# Altium project MiniR3.PrjPcb
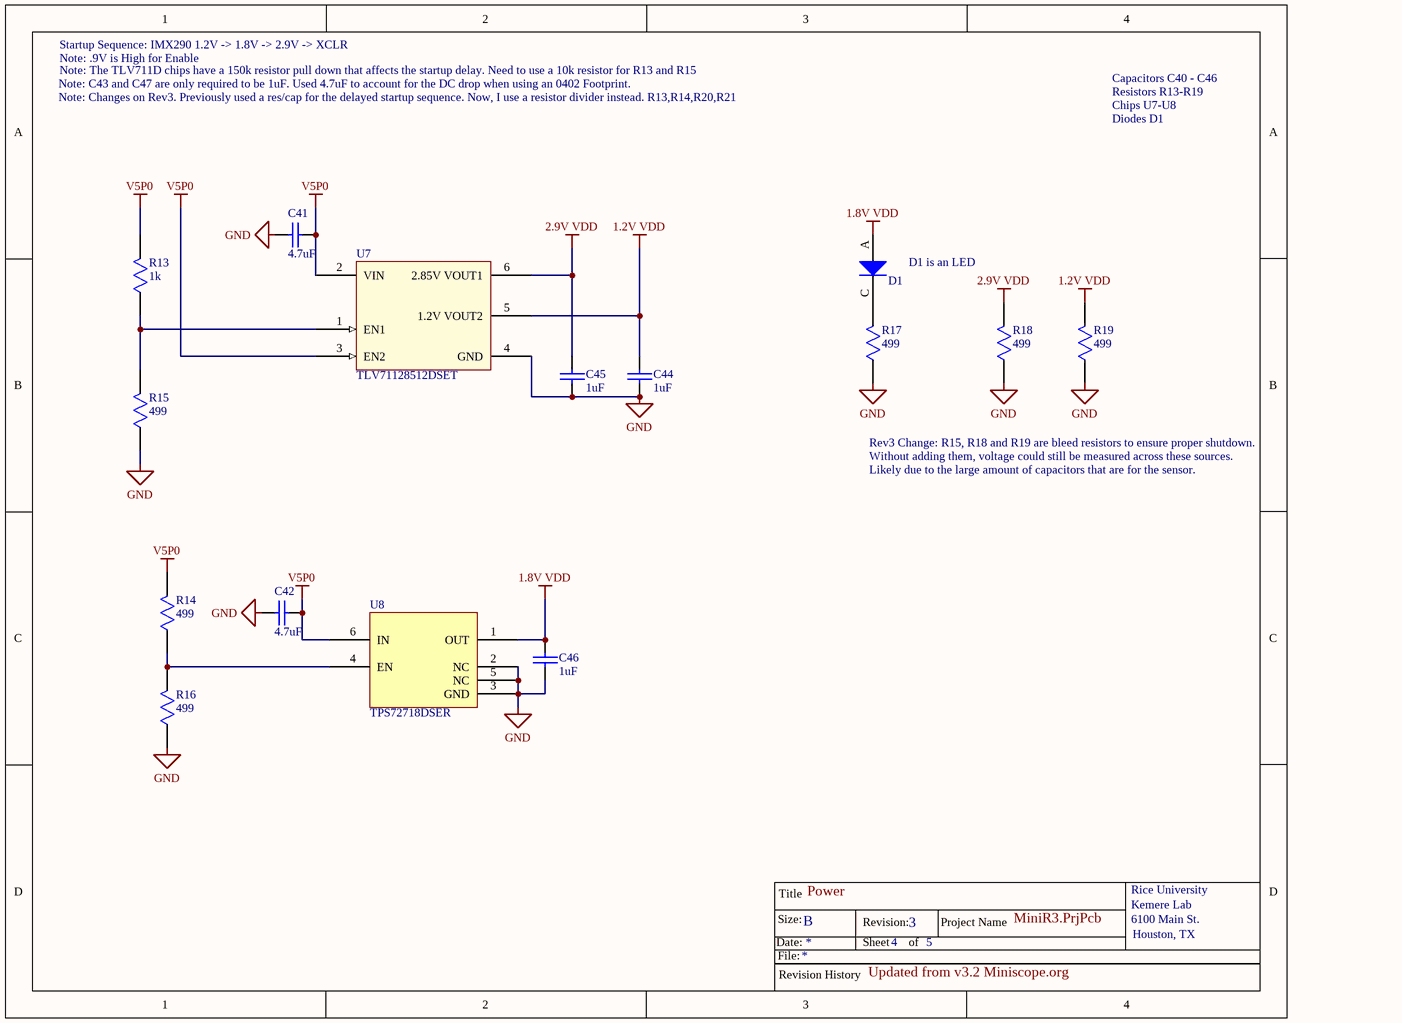
[diagram p0: PowerR3.SchDoc]
3 sheets, 62 parts. Net scope: flat (ports and power ports of the same name join across sheets).
Board file: MiniPCBR3.PcbDoc
Sheets:
  PowerR3.SchDoc
  Image_SensorR3.SchDoc
  LED_DriverR3.SchDoc

## Sheet PowerR3.SchDoc: Power
size A; Revision: 3; SheetNumber: 4; SheetTotal: 5; RevisionHistory: Updated from v3.2 Miniscope.org

### Parts
C41  4.7uF  [SMD CAP 0402]
C42  4.7uF  [SMD CAP 0402]
C44  1uF  [SMD CAP 0402]
C45  1uF  [SMD CAP 0402]
C46  1uF  [SMD CAP 0402]
D1  LED 0603  [LED_0603]  (value not drawn)
R13  1k  [SMD RES 0402]
R14  499  [SMD RES 0402]
R15  499  [SMD RES 0402]
R16  499  [SMD RES 0402]
R17  499  [SMD RES 0402]
R18  499  [SMD RES 0402]
R19  499  [SMD RES 0402]
U7  TLV71128512DSET  [DSE]
U8  TPS72718DSER  [DSE]

### Nets
1.2V VDD: C44.0 R19.1 U7.5(1.2V_VOUT2)
1.8V VDD: C46.1 D1.A U8.1(OUT)
2.9V VDD: C45.0 R18.1 U7.6(2.85V_VOUT1)
GND: C41.1 C42.0 C44.1 C45.1 C46.0 R15.0 R16.0 R17.0 R18.0 R19.0 U7.4(GND) U8.2(NC) U8.3(GND) U8.5(NC)
V5P0: C41.0 C42.1 R13.1 R14.1 U7.2(VIN) U7.3(EN2) U8.6(IN)
NetD1_C: D1.C R17.1
NetR13_0: R13.0 R15.1 U7.1(EN1)
NetR14_0: R14.0 R16.1 U8.4(EN)

### Notes on the sheet
- Note: C43 and C47 are only required to be 1uF. Used 4.7uF to account for the DC drop when using an 0402 Footprint.
- Note: Changes on Rev3. Previously used a res/cap for the delayed startup sequence. Now, I use a resistor divider instead. R13,R14,R20,R21
- Note: .9V is High for Enable
- Note: The TLV711D chips have a 150k resistor pull down that affects the startup delay. Need to use a 10k resistor for R13 and R15
- Startup Sequence: IMX290 1.2V -> 1.8V -> 2.9V -> XCLR
- Capacitors C40 - C46
- Resistors R13-R19
- Chips U7-U8
- Diodes D1
- (near D1) D1 is an LED
- Rev3 Change: R15, R18 and R19 are bleed resistors to ensure proper shutdown.
- Without adding them, voltage could still be measured across these sources.
- Likely due to the large amount of capacitors that are for the sensor.
- Title
- Rice University
- Kemere Lab
- Date:
- Size:
- File:
- Revision History
- B
- Revision:
- Sheet
- of
- Project Name
- 6100 Main St.
- Houston, TX

### Library data of the parts
C41 C42 C44-C46 = Capacitor: Value: C?
D1 = LED 0603: LTST_C195TBJRKT
R13-R19 = Resistor: Value: ?
U7 = TLV71128512DSET: Dual 2.85V and 1.2V Linear Regulator
U8 = TPS72718DSER: Single 1.8V Linear Regulator

## Sheet Image_SensorR3.SchDoc: Sony Image Sensor
size B; Revision: 3; SheetNumber: 2; SheetTotal: 5; RevisionHistory: Updated from v3.2 Miniscope.org
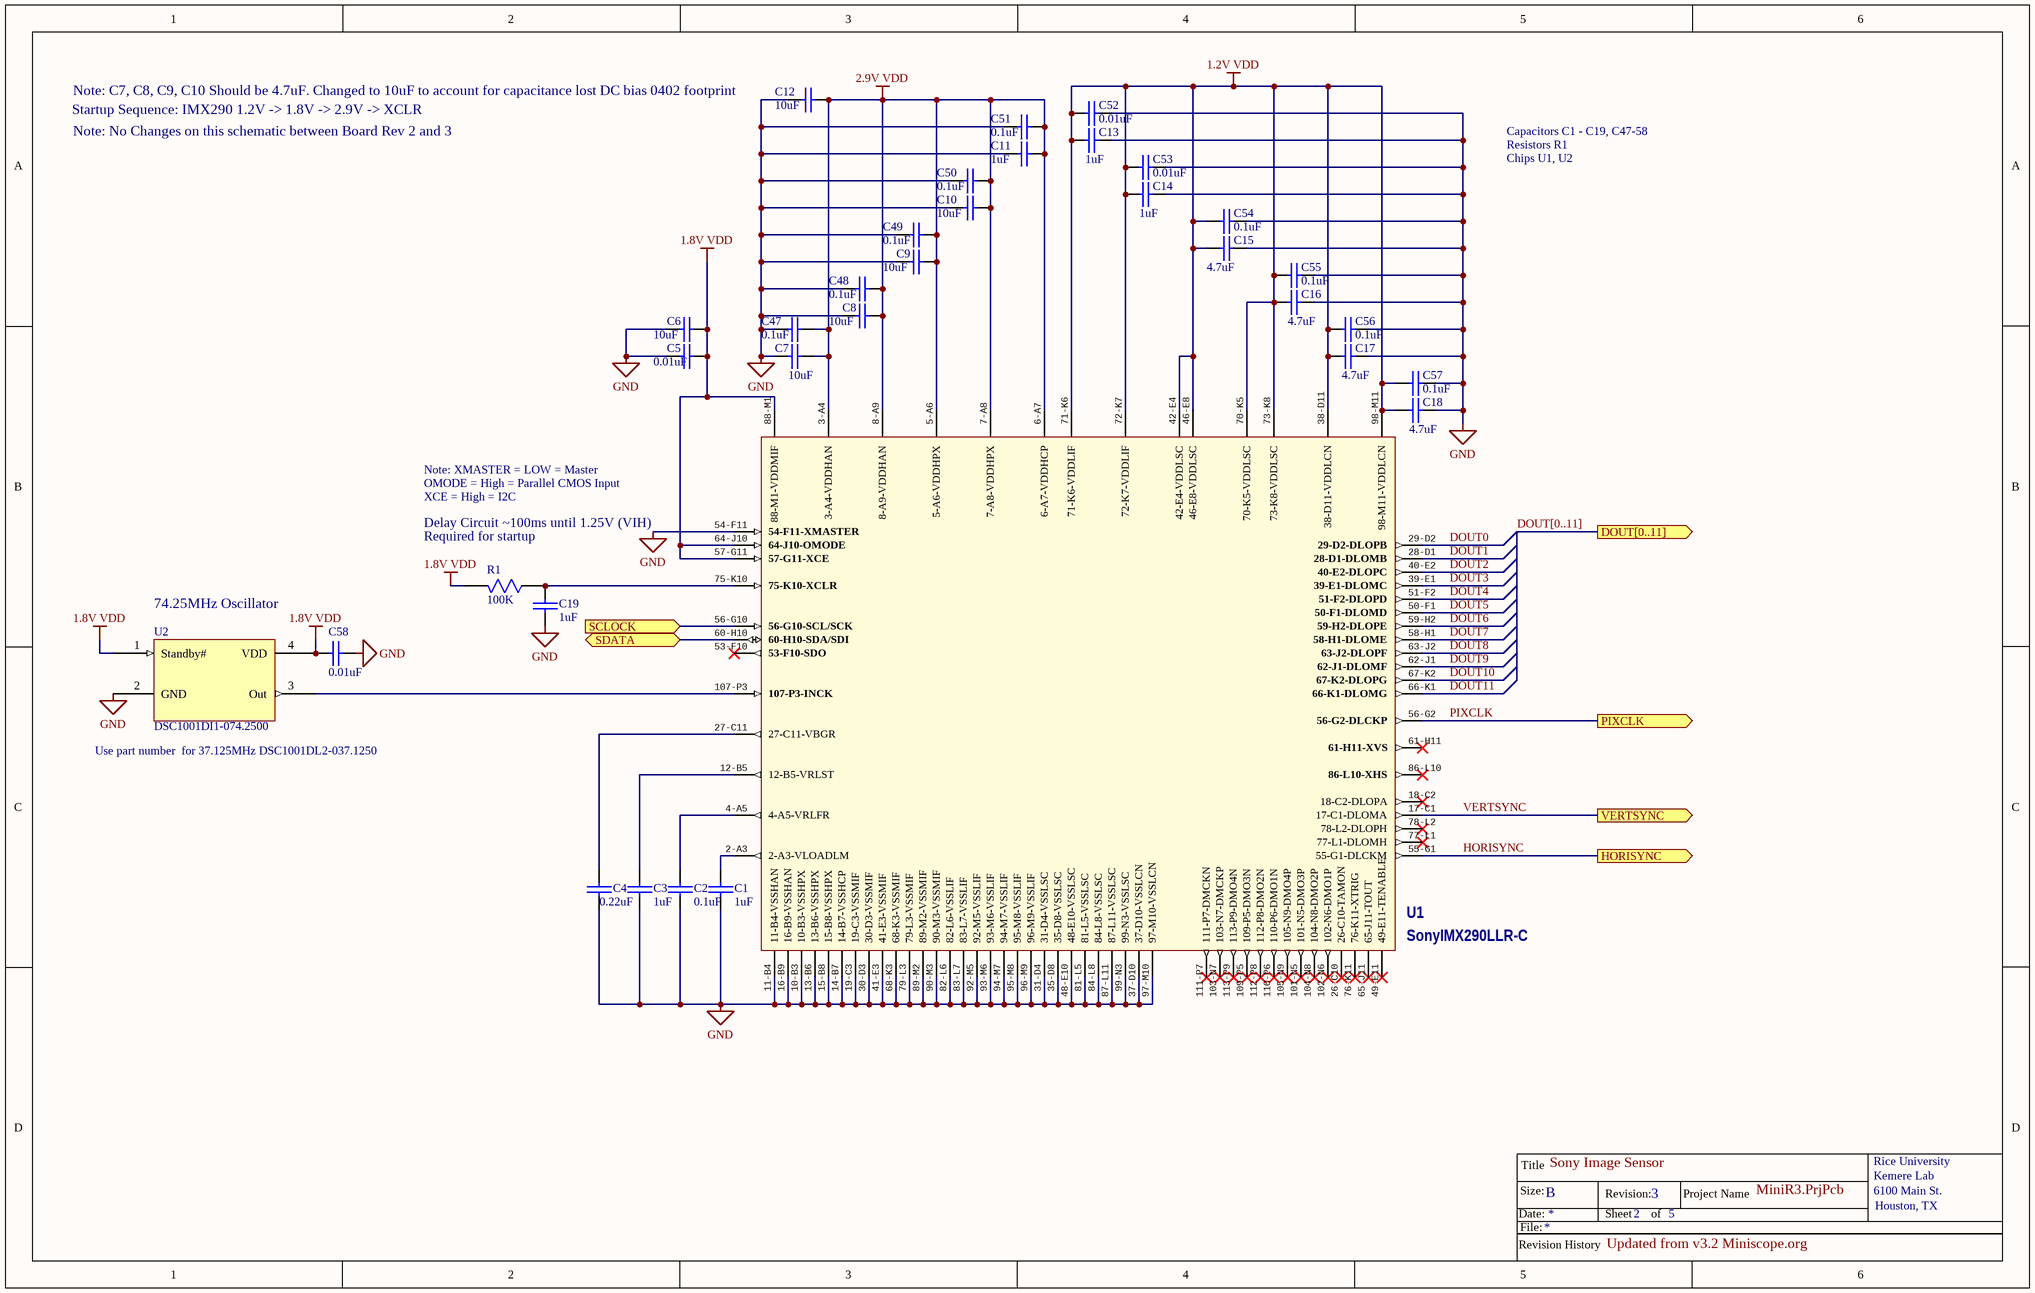
[diagram p1: Image_SensorR3.SchDoc]

### Parts
C1  1uF  [SMD CAP 0402]
C2  0.1uF  [SMD CAP 0402]
C3  1uF  [SMD CAP 0402]
C4  0.22uF  [SMD CAP 0402]
C5  0.01uF  [SMD CAP 0402]
C6  10uF  [SMD CAP 0402]
C7  10uF  [SMD CAP 0402]
C8  10uF  [SMD CAP 0402]
C9  10uF  [SMD CAP 0402]
C10  10uF  [SMD CAP 0402]
C11  1uF  [SMD CAP 0402]
C12  10uF  [SMD CAP 0402]
C13  1uF  [SMD CAP 0402]
C14  1uF  [SMD CAP 0402]
C15  4.7uF  [SMD CAP 0402]
C16  4.7uF  [SMD CAP 0402]
C17  4.7uF  [SMD CAP 0402]
C18  4.7uF  [SMD CAP 0402]
C19  1uF  [SMD CAP 0402]
C47  0.1uF  [SMD CAP 0402]
C48  0.1uF  [SMD CAP 0402]
C49  0.1uF  [SMD CAP 0402]
C50  0.1uF  [SMD CAP 0402]
C51  0.1uF  [SMD CAP 0402]
C52  0.01uF  [SMD CAP 0402]
C53  0.01uF  [SMD CAP 0402]
C54  0.1uF  [SMD CAP 0402]
C55  0.1uF  [SMD CAP 0402]
C56  0.1uF  [SMD CAP 0402]
C57  0.1uF  [SMD CAP 0402]
C58  0.01uF  [SMD CAP 0402]
R1  100K  [SMD RES 0402]
U1  SonyIMX290LLR-C  [110-LGA - Thin]
U2  DSC1001DI1-074.2500  [CDFN]

### Ports
DOUT[0..11] (out), HORISYNC (out), PIXCLK (out), SCLOCK (in), SDATA (bidir), VERTSYNC (out)

### Nets
1.2V VDD: C13.0 C14.0 C15.0 C16.0 C17.0 C18.0 C52.0 C53.0 C54.0 C55.0 C56.0 C57.0 U1.38-D11(38-D11-VDDLCN) U1.42-E4(42-E4-VDDLSC) U1.46-E8(46-E8-VDDLSC) U1.70-K5(70-K5-VDDLSC) U1.71-K6(71-K6-VDDLIF) U1.72-K7(72-K7-VDDLIF) U1.73-K8(73-K8-VDDLSC) U1.98-M11(98-M11-VDDLCN)
1.8V VDD: C5.1 C6.1 C58.1 R1.1 U1.57-G11(57-G11-XCE) U1.64-J10(64-J10-OMODE) U1.88-M1(88-M1-VDDMIF) U2.1(Standby#) U2.4(VDD)
2.9V VDD: C7.1 C8.1 C9.1 C10.1 C11.1 C12.1 C47.1 C48.1 C49.1 C50.1 C51.1 U1.3-A4(3-A4-VDDHAN) U1.5-A6(5-A6-VDDHPX) U1.6-A7(6-A7-VDDHCP) U1.7-A8(7-A8-VDDHPX) U1.8-A9(8-A9-VDDHAN)
GND: C1.0 C2.0 C3.0 C4.0 C5.0 C6.0 C7.0 C8.0 C9.0 C10.0 C11.0 C12.0 C13.1 C14.1 C15.1 C16.1 C17.1 C18.1 C19.0 C47.0 C48.0 C49.0 C50.0 C51.0 C52.1 C53.1 C54.1 C55.1 C56.1 C57.1 C58.0 U1.1-A1(1-A1-N.C.) U1.9-A11(9-A11-N.C.) U1.10-B3(10-B3-VSSHPX) U1.11-B4(11-B4-VSSHAN) U1.13-B6(13-B6-VSSHPX) U1.14-B7(14-B7-VSSHCP) U1.15-B8(15-B8-VSSHPX) U1.16-B9(16-B9-VSSHAN) U1.19-C3(19-C3-VSSMIF) U1.20-C4(20-C4-N.C.) U1.21-C5(21-C5-N.C.) U1.22-C6(22-C6-N.C.) U1.23-C7(23-C7-N.C.) U1.24-C8(24-C8-N.C.) U1.25-C9(25-C9-N.C.) U1.30-D3(30-D3-VSSMIF) U1.31-D4(31-D4-VSSLSC) U1.32-D5(32-D5-N.C.) U1.33-D6(33-D6-N.C.) U1.34-D7(34-D7-N.C.) U1.35-D8(35-D8-VSSLSC) U1.36-D9(36-D9-N.C.) U1.37-D10(37-D10-VSSLCN) U1.41-E3(41-E3-VSSMIF) U1.43-E5(43-E5-N.C.) U1.44-E6(44-E6-N.C.) U1.45-E7(45-E7-N.C.) U1.47-E9(47-E9-N.C.) U1.48-E10(48-E10-VSSLSC) U1.54-F11(54-F11-XMASTER) U1.68-K3(68-K3-VSSMIF) U1.69-K4(69-K4-N.C.) U1.74-K9(74-K9-N.C.) U1.79-L3(79-L3-VSSMIF) U1.80-L4(80-L4-N.C.) U1.81-L5(81-L5-VSSLSC) U1.82-L6(82-L6-VSSLIF) U1.83-L7(83-L7-VSSLIF) U1.84-L8(84-L8-VSSLSC) U1.85-L9(85-L9-N.C.) U1.87-L11(87-L11-VSSLSC) U1.89-M2(89-M2-VSSMIF) U1.90-M3(90-M3-VSSMIF) U1.91-M4(91-M4-N.C.) U1.92-M5(92-M5-VSSLIF) U1.93-M6(93-M6-VSSLIF) U1.94-M7(94-M7-VSSLIF) U1.95-M8(95-M8-VSSLIF) U1.96-M9(96-M9-VSSLIF) U1.97-M10(97-M10-VSSLCN) U1.99-N3(99-N3-VSSLSC) U1.100-N4(100-N4-N.C.) U1.106-P1(106-P1-N.C.) U1.108-P4(108-P4-N.C.) U1.114-P11(114-P11-N.C.) U2.2(GND)
DOUT0: U1.29-D2(29-D2-DLOPB)
DOUT1: U1.28-D1(28-D1-DLOMB)
DOUT2: U1.40-E2(40-E2-DLOPC)
DOUT3: U1.39-E1(39-E1-DLOMC)
DOUT4: U1.51-F2(51-F2-DLOPD)
DOUT5: U1.50-F1(50-F1-DLOMD)
DOUT6: U1.59-H2(59-H2-DLOPE)
DOUT7: U1.58-H1(58-H1-DLOME)
DOUT8: U1.63-J2(63-J2-DLOPF)
DOUT9: U1.62-J1(62-J1-DLOMF)
DOUT10: U1.67-K2(67-K2-DLOPG)
DOUT11: U1.66-K1(66-K1-DLOMG)
HORISYNC: U1.55-G1(55-G1-DLCKM) ; port HORISYNC
PIXCLK: U1.56-G2(56-G2-DLCKP) ; port PIXCLK
VERTSYNC: U1.17-C1(17-C1-DLOMA) ; port VERTSYNC
NetC1_1: C1.1 U1.2-A3(2-A3-VLOADLM)
NetC2_1: C2.1 U1.4-A5(4-A5-VRLFR)
NetC3_1: C3.1 U1.12-B5(12-B5-VRLST)
NetC4_1: C4.1 U1.27-C11(27-C11-VBGR)
NetC19_1: C19.1 R1.0 U1.75-K10(75-K10-XCLR)
NetU1_56-G10: U1.56-G10(56-G10-SCL/SCK) ; port SCLOCK
NetU1_60-H10: U1.60-H10(60-H10-SDA/SDI) ; port SDATA
NetU1_107-P3: U1.107-P3(107-P3-INCK) U2.3(Out)

Not connected (* = marked no-connect by the designer): U1 18-C2(18-C2-DLOPA)* 26-C10(26-C10-TAMON)* 49-E11(49-E11-TENABLE)* 53-F10(53-F10-SDO)* 61-H11(61-H11-XVS)* 65-J11(65-J11-TOUT)* 76-K11(76-K11-XTRIG)* 77-L1(77-L1-DLOMH)* 78-L2(78-L2-DLOPH)* 86-L10(86-L10-XHS)* 101-N5(101-N5-DMO3P)* 102-N6(102-N6-DMO1P)* 103-N7(103-N7-DMCKP)* 104-N8(104-N8-DMO2P)* 105-N9(105-N9-DMO4P)* 109-P5(109-P5-DMO3N)* 110-P6(110-P6-DMO1N)* 111-P7(111-P7-DMCKN)* 112-P8(112-P8-DMO2N)* 113-P9(113-P9-DMO4N)*

### Buses and harness runs
bus DOUT[0..11] = port DOUT[0..11]

### Notes on the sheet
- (near C12) Note: C7, C8, C9, C10 Should be 4.7uF. Changed to 10uF to account for capacitance lost DC bias 0402 footprint
- Startup Sequence: IMX290 1.2V -> 1.8V -> 2.9V -> XCLR
- Note: No Changes on this schematic between Board Rev 2 and 3
- Capacitors C1 - C19, C47-58
- Resistors R1
- Chips U1, U2
- Note: XMASTER = LOW = Master
- OMODE = High = Parallel CMOS Input
- XCE = High = I2C
- Delay Circuit ~100ms until 1.25V (VIH)
- Required for startup
- 74.25MHz Oscillator
- (near U2) Use part number  for 37.125MHz DSC1001DL2-037.1250
- Title
- Rice University
- Kemere Lab
- Date:
- Revision History
- Size:
- File:
- B
- Revision:
- Sheet
- of
- Project Name
- 6100 Main St.
- Houston, TX

### Library data of the parts
C1-C19 C47-C58 = Capacitor: Value: C?
R1 = Resistor: Value: ?
U1 = IMX290LLR-C: Sony Image Sensor
U2 = Microchip Oscillator: 74.25MHz Oscillator

## Sheet LED_DriverR3.SchDoc: LED Driver
size A; Revision: 3; SheetNumber: 5; SheetTotal: 5; RevisionHistory: Updated from v3.2 Miniscope.org
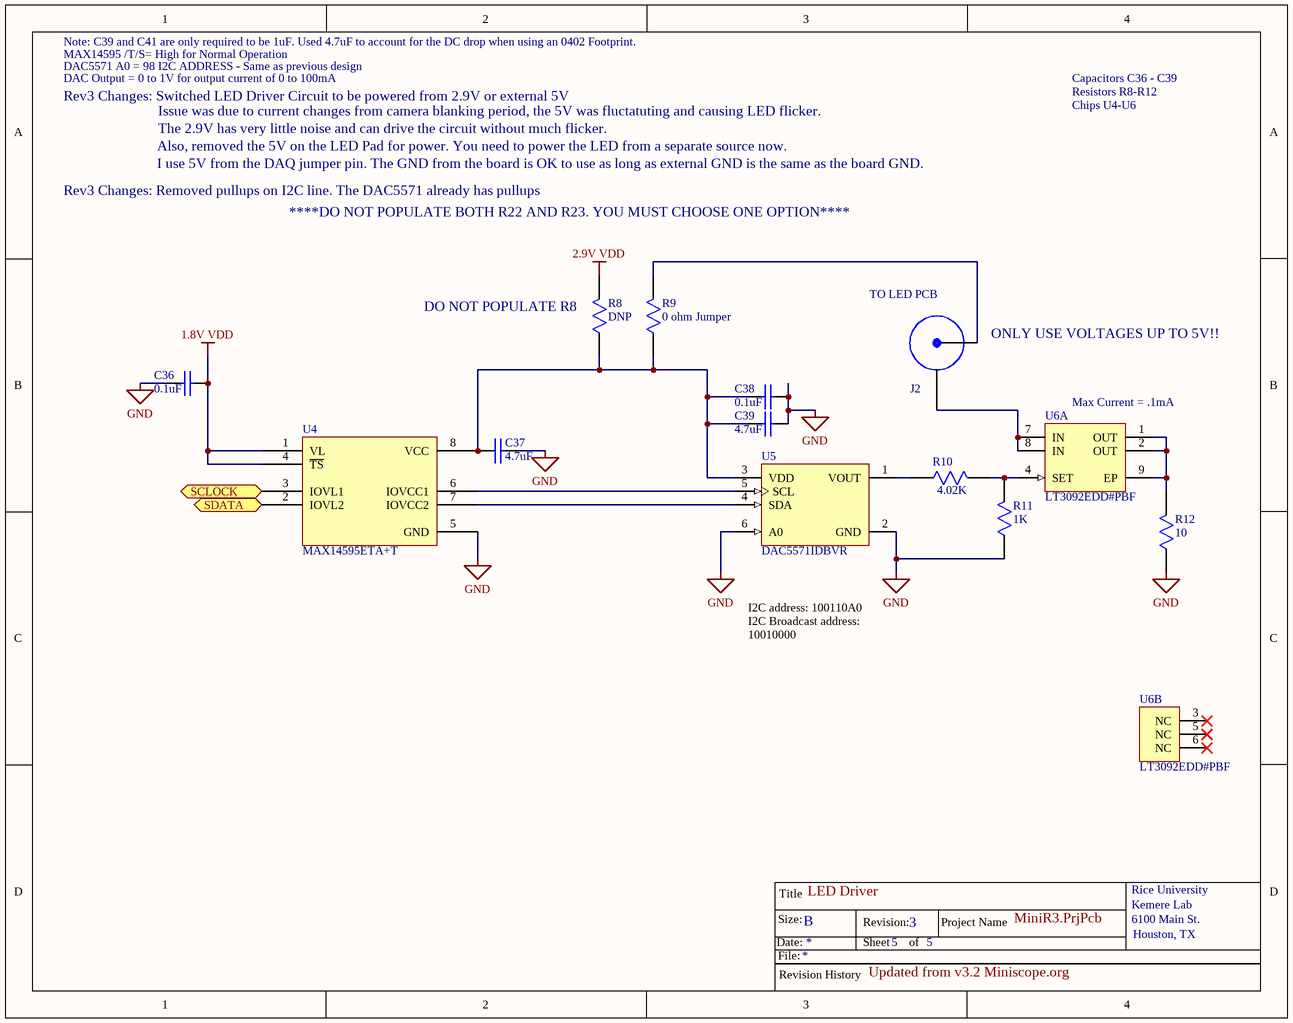
[diagram p2: LED_DriverR3.SchDoc]

### Parts
C36  0.1uF  [SMD CAP 0402]
C37  4.7uF  [SMD CAP 0402]
C38  0.1uF  [SMD CAP 0402]
C39  4.7uF  [SMD CAP 0402]
J2  Coax Connector  [Coax Direct Solder ThroughHoles]  (value not drawn)
R8  DNP  [SMD RES 0402]
R9  0 ohm Jumper  [SMD RES 0402]
R10  4.02K  [SMD RES 0402]
R11  1K  [SMD RES 0402]
R12  10  [SMD RES 0402]
U4  MAX14595ETA+T  [8 TDFN]
U5  DAC5571IDBVR  [DBV]
U6  LT3092EDD#PBF  [LT-DD-8_V]  (parts A,B of 2)

### Ports
SCLOCK (in), SDATA (bidir)

### Nets
1.8V VDD: C36.1 U4.1(VL) U4.4(~{TS})
2.9V VDD: R8.1
GND: C36.0 C37.1 C38.1 C39.1 R11.0 R12.0 U4.5(GND) U5.2(GND) U5.6(A0)
NetC37_0: C37.0 C38.0 C39.0 R8.0 R9.0 U4.8(VCC) U5.3(VDD)
NetJ2_0: J2.0 R9.1
NetJ2_1: J2.1 U6.7(IN) U6.8(IN)
NetR10_0: R10.0 U5.1(VOUT)
NetR10_1: R10.1 R11.1 U6.4(SET)
NetR12_1: R12.1 U6.1(OUT) U6.2(OUT) U6.9(EP)
NetU1_56-G10: U4.3(IOVL1) ; port SCLOCK
NetU1_60-H10: U4.2(IOVL2) ; port SDATA
NetU4_6: U4.6(IOVCC1) U5.5(SCL)
NetU4_7: U4.7(IOVCC2) U5.4(SDA)

Not connected (* = marked no-connect by the designer): U6 3(NC)* 5(NC)* 6(NC)*

### Notes on the sheet
- DAC Output = 0 to 1V for output current of 0 to 100mA
- Note: C39 and C41 are only required to be 1uF. Used 4.7uF to account for the DC drop when using an 0402 Footprint.
- MAX14595 /T/S= High for Normal Operation
- DAC5571 A0 = 98 I2C ADDRESS - Same as previous design
- Rev3 Changes: Switched LED Driver Circuit to be powered from 2.9V or external 5V
- Capacitors C36 - C39
- Resistors R8-R12
- Also, removed the 5V on the LED Pad for power. You need to power the LED from a separate source now.
- I use 5V from the DAQ jumper pin. The GND from the board is OK to use as long as external GND is the same as the board GND.
- Issue was due to current changes from camera blanking period, the 5V was fluctatuting and causing LED flicker.
- The 2.9V has very little noise and can drive the circuit without much flicker.
- Chips U4-U6
- Rev3 Changes: Removed pullups on I2C line. The DAC5571 already has pullups
- ****DO NOT POPULATE BOTH R22 AND R23. YOU MUST CHOOSE ONE OPTION****
- (near J2) TO LED PCB
- (near R8) DO NOT POPULATE R8
- ONLY USE VOLTAGES UP TO 5V!!
- (near U6) Max Current = .1mA
- I2C address: 100110A0
  I2C Broadcast address: 10010000
- Title
- Rice University
- Kemere Lab
- Date:
- Size:
- File:
- Revision History
- B
- Revision:
- Sheet
- of
- Project Name
- 6100 Main St.
- Houston, TX

### Library data of the parts
C36-C39 = Capacitor: Value: C?
R8-R12 = Resistor: Value: ?
U4 = MAX14595ETA+T: Level Translator
U5 = DAC5571
U6 = LT3092EDD#PBF: 200 mA Two-Terminal Programmable Current Source, 0.3 mA Isupply, 8-pin SON (DD-8), -40 to 125 degC, Pb-Free; Manufacturer: Linear Technology; Extended Temp: E, I, MP; Initial Accuracy(%): 1; Isupply(mA): 0.3; Output Current Range: 0.5 mA to 200 mA; Vin Max(V): 40; Vin Min(V): 1.2; DatasheetVersion: Rev. B; PackageVersion: Jun-10; PackageReference: DD-8; PackageDescription: 8-Pin Plastic DFN, Body 3 x 3 mm, Pitch 0.5 mm; Supplier 1: Digi-Key; Supplier Part Number 1: LT3092EDD#PBF-ND; Supplier 2: Farnell; Supplier Part Number 2: 2295468; Supplier 3: Newark; Supplier Part Number 3: 72R5810; RoHS: TRUE; Mounting Technology: Surface Mount; Code_JEDEC: MO-229; PartNumber: LT3092EDD#PBF; ComponentLink1Description: Manufacturer URL; ComponentLink1URL: http://www.linear.com/; ComponentLink2Description: Datasheet; ComponentLink2URL: http://cds.linear.com/docs/en/datasheet/3092fb.pdf; ComponentLink3Description: Package Specification; ComponentLink3URL: http://cds.linear.com/docs/en/packaging/DFN_8_05-08-1698.pdf

## Nets that join several sheets
1.2V VDD: PowerR3 (C44.0 R19.1 U7.5), Image_SensorR3 (20 pins)
1.8V VDD: PowerR3 (C46.1 D1.A U8.1), Image_SensorR3 (9 pins), LED_DriverR3 (C36.1 U4.1 U4.4)
2.9V VDD: PowerR3 (C45.0 R18.1 U7.6), Image_SensorR3 (16 pins), LED_DriverR3 (R8.1)
GND: PowerR3 (14 pins), Image_SensorR3 (87 pins), LED_DriverR3 (9 pins)
NetU1_56-G10: Image_SensorR3 (U1.56-G10), LED_DriverR3 (U4.3)
NetU1_60-H10: Image_SensorR3 (U1.60-H10), LED_DriverR3 (U4.2)